# EAGLE design PCB (EAGLE 8.3.1)
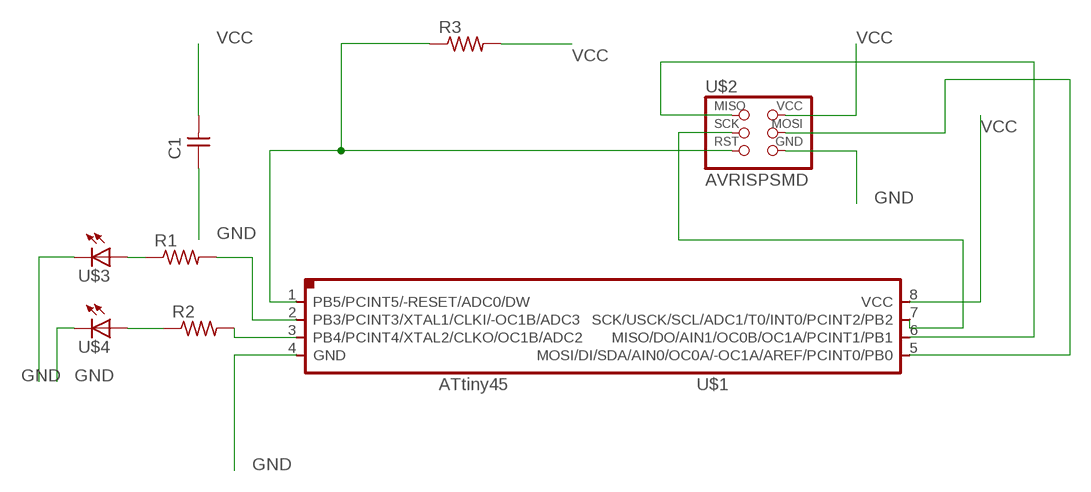
[diagram p0: schematic, sheet 1]

## Parts
C1  UNPOLARIZED_CAPACITOR1206  [1206]
R1  RESISTOR1206  [1206]
R2  RESISTOR1206  [1206]
R3  RESISTOR1206  [1206]
U$1  ATTINY45SI  [SOIC8]
U$2  AVRISPSMD  [2X03SMD]
U$3  LED1206  [1206]
U$4  LED1206  [1206]

## Nets
GND: C1.1 U$1.4(GND) U$2.6(GND) U$3.2(C) U$4.2(C)
N$1: R1.1 U$3.1(A)
N$2: R2.1 U$4.1(A)
N$3: U$1.7(SCK/USCK/SCL/ADC1/T0/INT0/PCINT2/PB2) U$2.3(SCK)
N$4: R3.1 U$1.1(PB5/PCINT5/-RESET/ADC0/DW) U$2.5(RST)
N$5: U$1.6(MISO/DO/AIN1/OC0B/OC1A/PCINT1/PB1) U$2.1(MISO)
N$6: U$1.5(MOSI/DI/SDA/AIN0/OC0A/-OC1A/AREF/PCINT0/PB0) U$2.4(MOSI)
N$7: R1.2 U$1.2(PB3/PCINT3/XTAL1/CLKI/-OC1B/ADC3)
N$8: R2.2 U$1.3(PB4/PCINT4/XTAL2/CLKO/OC1B/ADC2)
VCC: C1.2 R3.2 U$1.8(VCC) U$2.2(VCC)

## Library data of the parts
C1 = FabLab:UNPOLARIZED_CAPACITOR: unpolarized_capacitor
R1-R3 = FabLab:RESISTOR
U$1 = FabLab:ATTINY45
U$2 = FAB:AVRISP
U$3 U$4 = FabLab:LED

## Board
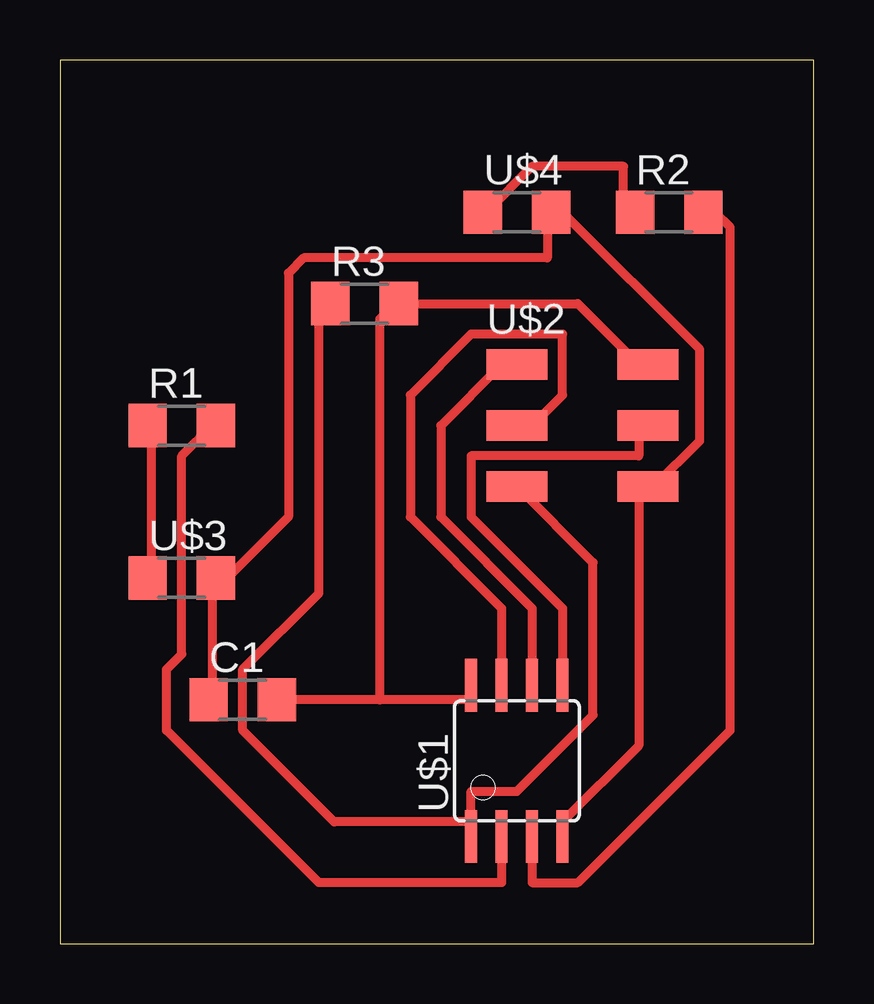
[diagram p1: board, top side]

Size 31.42 x 36.82 mm. Coordinates in mm from the lower left corner, seen from the top.
Outline: 0,0 31.42,0 31.42,36.82 0,36.82 0,0
Copper layers (1*16): Top 0.035mm / dielectric 1.5mm / Bottom 0.035mm
Design rules "default *": minimum track width 15mil, minimum drill 0.35mm, track to track 15mil, track to pad 15mil, pad to pad 15mil, via to via 15mil, smd to smd 15mil, copper to edge 40mil, drill to drill 6mil, minimum pad ring 10mil, minimum via ring 8mil, stop-mask expansion 4mil, vias tented up to drill 0mil, thermal gap 10mil

### Footprints (pad centres in the part's own frame; a part is rotated, then mirrored left to right if it is on the bottom)
1206 = smd 1.6 x 1.803: 1 -1.422,0; 2 1.422,0
SOIC8 = smd 0.5 x 2.2: 1 -1.905,-3.154; 2 -0.645,-3.154; 3 0.625,-3.154; 4 1.895,-3.154; 5 1.905,3.154; 6 0.635,3.154; 7 -0.635,3.154; 8 -1.905,3.154
2X03SMD = smd 2.54 x 1.27: 1 -2.54,2.54; 2 2.92,2.54; 3 -2.54,0; 4 2.92,0; 5 -2.54,-2.54; 6 2.92,-2.54

### Placement (x,y rotation side)
C1  7.62,10.16 0 top
R1  5.08,21.59 0 top
R2  25.4,30.48 0 top
R3  12.7,26.67 0 top
U$1  19.05,7.62 0 top
U$2  21.59,21.59 0 top
U$3  5.08,15.24 0 top
U$4  19.05,30.48 0 top

### Tracks (layer width: path | path; a pad name or v marks a point on that pad's centre or on a via)
GND
  Top 0.381: C1.1 6.35,10.16 6.35,15.24 U$3.2 6.99,15.24 9.53,17.78 9.53,27.94 10.16,28.57 20.32,28.57 20.32,30.48 U$4.2 20.95,30.48 26.67,24.76 26.67,20.95 24.77,19.05 U$2.6 24.13,19.05 24.13,8.25 20.95,5.08 U$1.4
N$1
  Top 0.381: U$3.1 3.81,15.24 3.81,21.59 R1.1
N$2
  Top 0.381: U$4.1 17.78,30.48 19.68,32.39 23.5,32.39 23.5,30.48 R2.1
N$3
  Top 0.381: U$1.7 18.41,13.97 14.61,17.78 14.61,22.86 17.14,25.4 20.95,25.4 20.95,22.86 19.68,21.59 U$2.3
N$4
  Top 0.381: 17.14,5.08 11.43,5.08 7.62,8.89 7.62,11.43 10.79,14.61 10.79,26.67 R3.1 | U$2.5 22.23,15.88 22.23,9.52 19.05,6.35 17.14,6.35 17.14,5.08 | 17.14,5.08 U$1.1
N$5
  Top 0.381: U$1.6 19.68,13.97 15.88,17.78 15.88,21.59 18.41,24.13 U$2.1
N$6
  Top 0.381: U$1.5 20.95,13.97 17.14,17.78 17.14,20.32 24.13,20.32 24.13,21.59 U$2.4
N$7
  Top 0.381: R1.2 6.35,21.59 5.08,20.32 5.08,12.07 4.45,11.43 4.45,8.89 10.79,2.54 18.41,2.54 18.41,4.45 U$1.2
N$8
  Top 0.381: U$1.3 19.68,4.45 19.68,2.54 21.59,2.54 27.94,8.89 27.94,29.85 27.3,30.48 R2.2
VCC
  Top 0.381: 13.34,10.16 17.14,10.16 U$1.8 | 13.34,10.16 C1.2 | 13.34,10.16 13.34,26.04 13.97,26.67 R3.2 21.59,26.67 24.13,24.13 U$2.2